# Altium project EMG_Sensor_Board.PrjPcb (part 1 of 2)
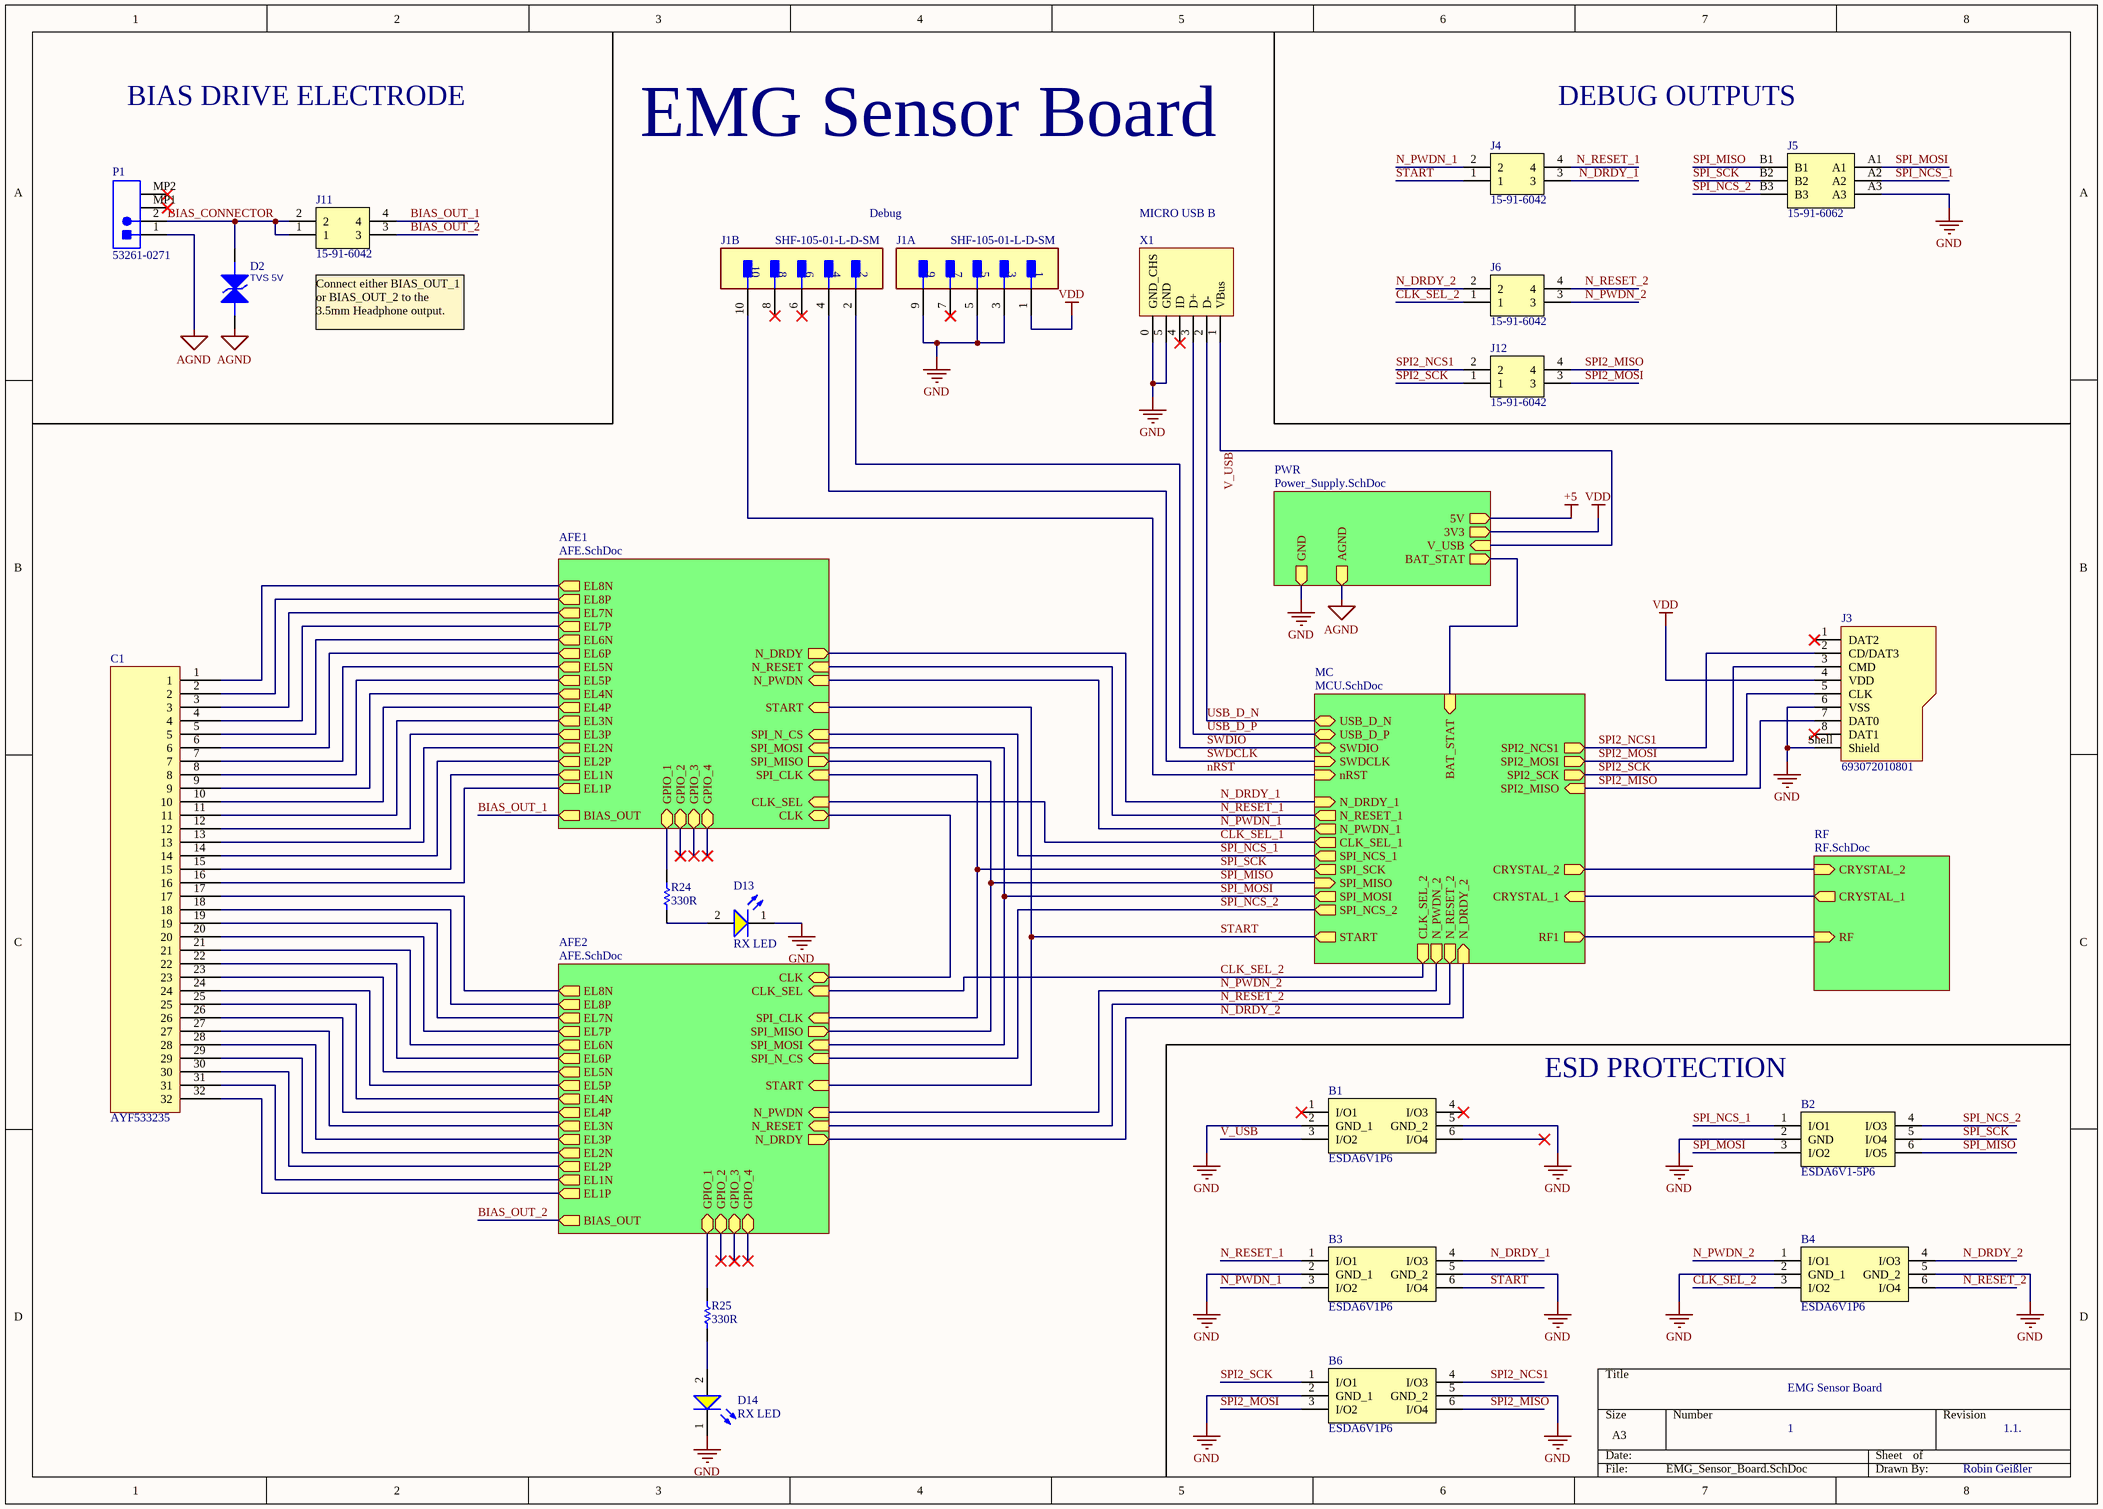
[diagram p0: EMG_Sensor_Board.SchDoc]
6 sheets, 216 parts. Net scope: hierarchical (ports join the sheet entries above them; power ports are global).
Board file: PCB1.PcbDoc
Sheets:
  EMG_Sensor_Board.SchDoc
    MC = MCU.SchDoc
    PWR = Power_Supply.SchDoc
    AFE1 = AFE.SchDoc
      FL7 = Filter.SchDoc
      FL6 = Filter.SchDoc
      FL8 = Filter.SchDoc
      FL5 = Filter.SchDoc
      FL4 = Filter.SchDoc
      FL3 = Filter.SchDoc
      FL2 = Filter.SchDoc
      FL1 = Filter.SchDoc
    RF = RF.SchDoc
    AFE2 = AFE.SchDoc
      FL7 = Filter.SchDoc
      FL6 = Filter.SchDoc
      FL8 = Filter.SchDoc
      FL5 = Filter.SchDoc
      FL4 = Filter.SchDoc
      FL3 = Filter.SchDoc
      FL2 = Filter.SchDoc
      FL1 = Filter.SchDoc

## Sheet EMG_Sensor_Board.SchDoc: EMG Sensor Board
size A3; Date: 15.05.2024; Author: Robin Geißler; CompanyName: Fraunhofer EMFT; DrawnBy: Robin Geißler; Revision: 1.1.; SheetNumber: 1; SheetTotal: 6

### Parts
B1  ESDA6V1P6  [ESDA6V1P6]
B2  ESDA6V1-5P6  [ESDA6V15P6]
B3  ESDA6V1P6  [ESDA6V1P6]
B4  ESDA6V1P6  [ESDA6V1P6]
B6  ESDA6V1P6  [ESDA6V1P6]
C1  AYF533235  [AYF533235]
D2  TVS 5V  [C-1608 [0603]-N]
D13  RX LED  [WL-SMCW_0603_150060xx75000]
D14  RX LED  [WL-SMCW_0603_150060xx75000]
J1  SHF-105-01-L-D-SM  [FP-SHF-105-01-L-D-SM-MFG]  (parts A,B of 2)
J3  693072010801  [693072010801]
J4  15-91-6042  [15916042]
J5  15-91-6062  [15916062]
J6  15-91-6042  [15916042]
J11  15-91-6042  [15916042]
J12  15-91-6042  [15916042]
P1  53261-0271  [MOLX-53261-0271_V]
R24  330R  [RESC1608X55X30LL15T15]
R25  330R  [RESC1608X55X30LL15T15]
X1  MICRO USB B  [Micro USB B]

### Sub-sheets
AFE1 = AFE.SchDoc: SPI_MISO (out), SPI_N_CS (in), SPI_CLK (in), N_DRDY (out), CLK (bidir), CLK_SEL (in), GPIO_1 (bidir), GPIO_2 (bidir), GPIO_3 (bidir), GPIO_4 (bidir), START (in), N_RESET (in), N_PWDN (in), EL1P (out), EL1N (out), EL2P (out), EL2N (out), EL3P (out), EL3N (out), EL4P (out), EL4N (out), EL5P (out), EL5N (out), EL6P (out), EL6N (out), EL7P (out), EL7N (out), EL8P (out), EL8N (out), BIAS_OUT (out), SPI_MOSI (in)
AFE2 = AFE.SchDoc: SPI_MISO (out), SPI_N_CS (in), SPI_CLK (in), N_DRDY (out), CLK (bidir), CLK_SEL (in), GPIO_1 (bidir), GPIO_2 (bidir), GPIO_3 (bidir), GPIO_4 (bidir), START (in), N_RESET (in), N_PWDN (in), EL1P (out), EL1N (out), EL2P (out), EL2N (out), EL3P (out), EL3N (out), EL4P (out), EL4N (out), EL5P (out), EL5N (out), EL6P (out), EL6N (out), EL7P (out), EL7N (out), EL8P (out), EL8N (out), BIAS_OUT (out), SPI_MOSI (in)
MC = MCU.SchDoc: SWDIO (bidir), SWDCLK (in), nRST (in), SPI_SCK (out), SPI_MISO (in), SPI_MOSI (out), SPI_NCS_1 (out), SPI_NCS_2 (out), USB_D_P (bidir), USB_D_N (bidir), RF1 (out), START (out), N_DRDY_1 (in), N_RESET_1 (out), N_PWDN_1 (out), N_DRDY_2 (in), N_RESET_2 (out), N_PWDN_2 (out), CLK_SEL_1 (out), CLK_SEL_2 (out), CRYSTAL_2 (out), CRYSTAL_1 (in), BAT_STAT (in), SPI2_MOSI (out), SPI2_MISO (in), SPI2_SCK (out), SPI2_NCS1 (out)
PWR = Power_Supply.SchDoc: V_USB (in), BAT_STAT (out), 5V (out), 3V3 (out), GND (out), AGND (out)
RF = RF.SchDoc: RF (in), CRYSTAL_1 (out), CRYSTAL_2 (in)

### Nets
AGND: D2.2(ANODE) P1.1 ; sheet PWR/AGND
GND: B1.2(GND_1) B1.5(GND_2) B2.2(GND) B3.2(GND_1) B3.5(GND_2) B4.2(GND_1) B4.5(GND_2) B6.2(GND_1) B6.5(GND_2) D13.1(K) D14.1(K) J1.3 J1.5 J1.9 J3.6(VSS) J3.Shell(Shield) J5.A3 X1.0(GND_CHS) X1.5(GND) ; sheet PWR/GND
VDD: J1.1 J3.4(VDD) ; sheet PWR/3V3  [project net 3V3]
BAT_STAT: sheet MC/BAT_STAT, sheet PWR/BAT_STAT
BIAS_CONNECTOR: D2.1(CATHODE) J11.1 J11.2 P1.2
BIAS_OUT_1: J11.4 ; sheet AFE1/BIAS_OUT
BIAS_OUT_2: J11.3 ; sheet AFE2/BIAS_OUT
CLK_SEL_1: sheet MC/CLK_SEL_1, sheet AFE1/CLK_SEL
CLK_SEL_2: B4.3(I/O2) J6.1 ; sheet MC/CLK_SEL_2, sheet AFE2/CLK_SEL
CRYSTAL_1: sheet MC/CRYSTAL_1, sheet RF/CRYSTAL_1
CRYSTAL_2: sheet MC/CRYSTAL_2, sheet RF/CRYSTAL_2
N_DRDY_1: B3.4(I/O3) J4.3 ; sheet MC/N_DRDY_1, sheet AFE1/N_DRDY
N_DRDY_2: B4.4(I/O3) J6.2 ; sheet MC/N_DRDY_2, sheet AFE2/N_DRDY
N_PWDN_1: B3.3(I/O2) J4.2 ; sheet MC/N_PWDN_1, sheet AFE1/N_PWDN
N_PWDN_2: B4.1(I/O1) J6.3 ; sheet MC/N_PWDN_2, sheet AFE2/N_PWDN
N_RESET_1: B3.1(I/O1) J4.4 ; sheet MC/N_RESET_1, sheet AFE1/N_RESET
N_RESET_2: B4.6(I/O4) J6.4 ; sheet MC/N_RESET_2, sheet AFE2/N_RESET
nRST: J1.10 ; sheet MC/nRST
RF1: sheet MC/RF1, sheet RF/RF
SPI2_MISO: B6.6(I/O4) J3.7(DAT0) J12.4 ; sheet MC/SPI2_MISO
SPI2_MOSI: B6.3(I/O2) J3.3(CMD) J12.3 ; sheet MC/SPI2_MOSI
SPI2_NCS1: B6.4(I/O3) J3.2(CD/DAT3) J12.2 ; sheet MC/SPI2_NCS1
SPI2_SCK: B6.1(I/O1) J3.5(CLK) J12.1 ; sheet MC/SPI2_SCK
SPI_MISO: B2.6(I/O5) J5.B1 ; sheet MC/SPI_MISO, sheet AFE1/SPI_MISO, sheet AFE2/SPI_MISO
SPI_MOSI: B2.3(I/O2) J5.A1 ; sheet MC/SPI_MOSI, sheet AFE1/SPI_MOSI, sheet AFE2/SPI_MOSI
SPI_NCS_1: B2.1(I/O1) J5.A2 ; sheet MC/SPI_NCS_1, sheet AFE1/SPI_N_CS
SPI_NCS_2: B2.4(I/O3) J5.B3 ; sheet MC/SPI_NCS_2, sheet AFE2/SPI_N_CS
SPI_SCK: B2.5(I/O4) J5.B2 ; sheet MC/SPI_SCK, sheet AFE1/SPI_CLK, sheet AFE2/SPI_CLK
START: B3.6(I/O4) J4.1 ; sheet MC/START, sheet AFE1/START, sheet AFE2/START
SWDCLK: J1.4 ; sheet MC/SWDCLK
SWDIO: J1.2 ; sheet MC/SWDIO
USB_D_N: X1.2(D-) ; sheet MC/USB_D_N
USB_D_P: X1.3(D+) ; sheet MC/USB_D_P
V_USB: B1.3(I/O2) X1.1(VBus) ; sheet PWR/V_USB
NetC1_1: C1.1 ; sheet AFE1/EL8N
NetC1_2: C1.2 ; sheet AFE1/EL8P
NetC1_3: C1.3 ; sheet AFE1/EL7N
NetC1_4: C1.4 ; sheet AFE1/EL7P
NetC1_5: C1.5 ; sheet AFE1/EL6N
NetC1_6: C1.6 ; sheet AFE1/EL6P
NetC1_7: C1.7 ; sheet AFE1/EL5N
NetC1_8: C1.8 ; sheet AFE1/EL5P
NetC1_9: C1.9 ; sheet AFE1/EL4N
NetC1_10: C1.10 ; sheet AFE1/EL4P
NetC1_11: C1.11 ; sheet AFE1/EL3N
NetC1_12: C1.12 ; sheet AFE1/EL3P
NetC1_13: C1.13 ; sheet AFE1/EL2N
NetC1_14: C1.14 ; sheet AFE1/EL2P
NetC1_15: C1.15 ; sheet AFE1/EL1N
NetC1_16: C1.16 ; sheet AFE1/EL1P
NetC1_17: C1.17 ; sheet AFE2/EL8N
NetC1_18: C1.18 ; sheet AFE2/EL8P
NetC1_19: C1.19 ; sheet AFE2/EL7N
NetC1_20: C1.20 ; sheet AFE2/EL7P
NetC1_21: C1.21 ; sheet AFE2/EL6N
NetC1_22: C1.22 ; sheet AFE2/EL6P
NetC1_23: C1.23 ; sheet AFE2/EL5N
NetC1_24: C1.24 ; sheet AFE2/EL5P
NetC1_25: C1.25 ; sheet AFE2/EL4N
NetC1_26: C1.26 ; sheet AFE2/EL4P
NetC1_27: C1.27 ; sheet AFE2/EL3N
NetC1_28: C1.28 ; sheet AFE2/EL3P
NetC1_29: C1.29 ; sheet AFE2/EL2N
NetC1_30: C1.30 ; sheet AFE2/EL2P
NetC1_31: C1.31 ; sheet AFE2/EL1N
NetC1_32: C1.32 ; sheet AFE2/EL1P
NetD13_2: D13.2(A) R24.1
NetD14_2: D14.2(A) R25.2
NetR24_2: R24.2 ; sheet AFE1/GPIO_1
NetR25_1: R25.1 ; sheet AFE2/GPIO_1
NetU?#1_37: sheet AFE1/CLK, sheet AFE2/CLK

Not connected (* = marked no-connect by the designer): B1 1(I/O1)* 4(I/O3)* 6(I/O4)*; J1 6* 7* 8*; J3 1(DAT2)* 8(DAT1)*; P1 MP1* MP2*; X1 4(ID)*

### Notes on the sheet
- BIAS DRIVE ELECTRODE
- DEBUG OUTPUTS
- EMG Sensor Board
- Debug
- (near J11) Connect either BIAS_OUT_1 or BIAS_OUT_2 to the 3.5mm Headphone output.
- ESD PROTECTION

### Library data of the parts
B1 B3 B4 B6 = ESDA6V1P6: 4 line ESD protection, 6.1 V VBR, in SOT666; Manufacturer_Name: STMicroelectronics; Geometry.Height: 0.62mm; Manufacturer_Part_Number: ESDA6V1P6; Mouser Part Number: 511-ESDA6V1P6; Mouser Price/Stock: https://www.mouser.co.uk/ProductDetail/STMicroelectronics/ESDA6V1P6?qs=ewe0KQ%2FSs5H0%252BSAub%2FR2ag%3D%3D; Arrow Part Number: ESDA6V1P6; Arrow Price/Stock: https://www.arrow.com/en/products/esda6v1p6/stmicroelectronics?region=nac; Datasheet Link: https://www.st.com/resource/en/datasheet/esda14v2bp6.pdf
  B1 B3: Supplier 1: Mouser; Supplier Part Number 1: 511-ESDA6V1P6
B2 = ESDA6V1-5P6: 5 line ESD protection, 6.1 V VBR, in SOT666; Manufacturer_Name: STMicroelectronics; Geometry.Height: 0.62mm; Manufacturer_Part_Number: ESDA6V1-5P6; Mouser Part Number: 511-ESDA6V1-5P6; Mouser Price/Stock: https://www.mouser.co.uk/ProductDetail/STMicroelectronics/ESDA6V1-5P6?qs=at%2FPaO0D8JbsyvB5MtIioA%3D%3D; Arrow Part Number: ESDA6V1-5P6; Arrow Price/Stock: https://www.arrow.com/en/products/esda6v1-5p6/stmicroelectronics?region=nac; Datasheet Link: https://www.st.com/resource/en/datasheet/esda14v2bp6.pdf
D2 = D_TVS_0603_CG0603MLU-05E: ESD-Entstörer/TVS-Dioden CHIP GUARD 5VOLT; Supplier 1 No: 652-CG0603MLU-05E; Supplier 1: Mouser
D13 D14 = CMP-1426-00005-2: NexarPartId: 29687085; Wavelength: 590nm; Luminous Intensity: 120mcd; Peak Wavelength: 595nm; Forward Current: 100mA; Power Dissipation: 72mW; Color: Yellow; Forward Voltage: 2V; Test Current: 20mA; Reverse Voltage: 5V; Lens Style: Clear, Rectangular; Max Junction Temperature (Tj): 95°C; Viewing Angle: 140°; Case Code (Imperial): 0603; Height: 700µm; REACH SVHC: Unknown; Dominant Wavelength: 590nm; Min Operating Temperature: -40°C; Width: 800µm; Mount: Surface Mount; Packaging: Tape and Reel; Max Operating Temperature: 85°C; RoHS: Compliant; Max Reverse Voltage (DC): 5V; Case Code (Metric): 1608; Length: 1.6mm; Case/Package: 0603
J1 = CMP-02766-000087-1: CONN HEADER SMD 10POS 1.27MM; Manufacturer: Samtec; Number Of Contacts: 10; Conn Gender: Male; Conn Orientation: Straight; Automotive: No; Lead Free: Yes; Contact Material: Gold,Nickel; Digikey Description: CONN HEADER SMD 10POS 1.27MM; Device Class L3: unset; Device Class L2: Headers and Wire Housings; RoHS: TRUE; Number Of Rows: 2; Package: SHF-105-01-L-D-SM; Pitch: 1.27mm; Octopart: https://octopart.com/shf-105-01-l-d-sm-samtec-17879411; Temperature Range Low: -55°C; Height: 5.59mm; ComponentLink2Description: Datasheet; Category: Conn; Manufacturer Part Number: SHF-105-01-L-D-SM; Device Class L1: Connectors; Mouser Description: In a Pack of 2, Samtec SHF, 1.27mm Pitch, 10 Way, 2 Row, Straight PCB Header, Surface Mount; Temperature Range High: +125°C; ComponentLink2URL: http://suddendocs.samtec.com/catalog_english/shf.pdf; Footprint Url: http://suddendocs.samtec.com/prints/shf-1xx-01-x-d-xx-xx-footprint.pdf; Temperature: -55°C to +125°C
J3 = CMP-1502-00164-2: NexarPartId: 22866686; Voltage Rating: 100V; Insulation Resistance: 1GΩ; Current Rating: 500mA; Memory Type: FLASH; Number of Positions: 8; Connector Type: Connector; Width: 13.5mm; Number of Pins: 8; REACH SVHC: Unknown; Contact Material: Copper, Gold; Contact Plating: Gold; Max Operating Temperature: 85°C; Color: Black; Operating Supply Voltage: 100V; Packaging: Tape and Reel; RoHS: Compliant; Height: 1.75mm; Number of Contacts: 8; Mount: Surface Mount; Length: 14.5mm; Min Operating Temperature: -25°C
J4 J6 J11 J12 = 15-91-6042: 2.54mm Pitch SL Wire-to-Board Header, Low Profile, Surface Mount, Single Row, Right-Angle, 3.05mm Pocket, Shrouded, with Press-fit Plastic Peg,  Circuits, Tin (Sn) Plating, Embossed Tape Packaging; Manufacturer_Name: Molex; Geometry.Height: 11.69mm; Manufacturer_Part_Number: 15-91-6042; Mouser Part Number: 538-15-91-6042; Mouser Price/Stock: https://www.mouser.co.uk/ProductDetail/Molex/15-91-6042?qs=3DzawVMofg8HeBuyct9LCA%3D%3D; Arrow Part Number: *; Arrow Price/Stock: *; Datasheet Link: https://componentsearchengine.com/Datasheets/1/15-91-6042.pdf
J5 = 15-91-6062: 2.54mm Pitch SL Wire-to-Board Header, Low Profile, Surface Mount, Single Row, Right-Angle, 3.05mm Pocket, Shrouded, with Press-fit Plastic Peg,  Circuits, Tin (Sn) Plating, Embossed Tape Packaging; Manufacturer_Name: Molex; Geometry.Height: 9.91mm; Manufacturer_Part_Number: 15-91-6062; Mouser Part Number: 538-15-91-6062; Mouser Price/Stock: https://www.mouser.co.uk/ProductDetail/Molex/15-91-6062?qs=Wx%252BBqzKDvcssfuSpK%2FN0NQ%3D%3D; Arrow Part Number: *; Arrow Price/Stock: *; Datasheet Link: https://www.molex.com/content/dam/molex/molex-dot-com/products/automated/en-us/salesdrawingpdf/713/71308/015916062_sd.pdf
P1 = CMP-2000-05633-1: PicoBlade(TM) Header, Right Angle, -40 to 85 degC, 2-Pin SMD, RoHS, Tape and Reel; Current - Max: 1A; Brand: Molex; Voltage Rating: 125V; Number of Positions: 2; Pitch: 1.25mm; Package Version: Rev. H, 11/2014; Factory Pack Quantity: 1000; Datasheet URL: http://www.molex.com/webdocs/datasheets/pdf/en-us/0532610271_PCB_HEADERS.pdf; Datasheet Version: 03/2016; Housing Material: Thermoplastic; RoHS: Details; Product Type: Headers; Number of Rows: 1; Termination Style: SMD; Mounting Technology: SurfaceMount; Number of Positions / Contacts: 2; Package URL: http://www.molex.com/pdm_docs/sd/532610271_sd.pdf; Mounting Angle: Right; Mounting Style: SMD/SMT; Manufacturer: Molex; Product Category: 1.25mmConnectors; Tradename: PicoBlade; Voltage - Max: 125V; Manufacturer URL: http://www.molex.com/; Series: 53261; Package Description: 2-Leads Header, Pitch 1.25 mm, Mated Height 3.4 mm; Package Reference: 53261-0271; Current Rating: 1A; Contact Plating: Tin; Contact Material: PhosphorBronze; Type: Shrouded; Packaging: Reel
R24 R25 = CMP-2000-00435-2: Chip Resistor, 330 Ohm, +/- 1%, 0.1 W, -55 to 155 degC, 0603 (1608 Metric), RoHS, Tape and Reel; Gender: Male; Mating Cycles: 10000; Current Rating: 500 mA; Voltage Rating: 10 V; REACH SVHC: No SVHC; PackageDescription: 2-Pin Surface Mount Device, Body 1.6 x 0.85 mm; Contact Finish: Gold; Pins: 8; ComponentLink1Description: Manufacturer URL; Packaging: Tape and Reel; Max Operating Temperature: 85 degC; Contact Material: Copper; Height: 1.45 mm; Width: 1.45 mm; DatasheetVersion: Apr-15; Package Quantity: 1500; Contact Plating: Gold; PackageReference: 0603; Mount: Surface Mount; Lead Pitch: 1.1 mm; Min Operating Temperature: -25 degC; ComponentLink1URL: http://www.panasonic.com/; ComponentLink2URL: http://industrial.panasonic.com/cdbs/www-data/pdf/RDA0000/AOA0000C86.pdf; Length: 13.7 mm; ComponentLink2Description: Datasheet; RoHSCompliant: true
X1 = MICRO USB B: MICRO USB B Molex; Supplier 1: Mouser; Supplier Part Number 1: 538-47346-0001

## Sheet MCU.SchDoc: Main Control Unit
size A4; DrawnBy: Robin Geißler; Revision: 1.0.; SheetNumber: 3; SheetTotal: 6
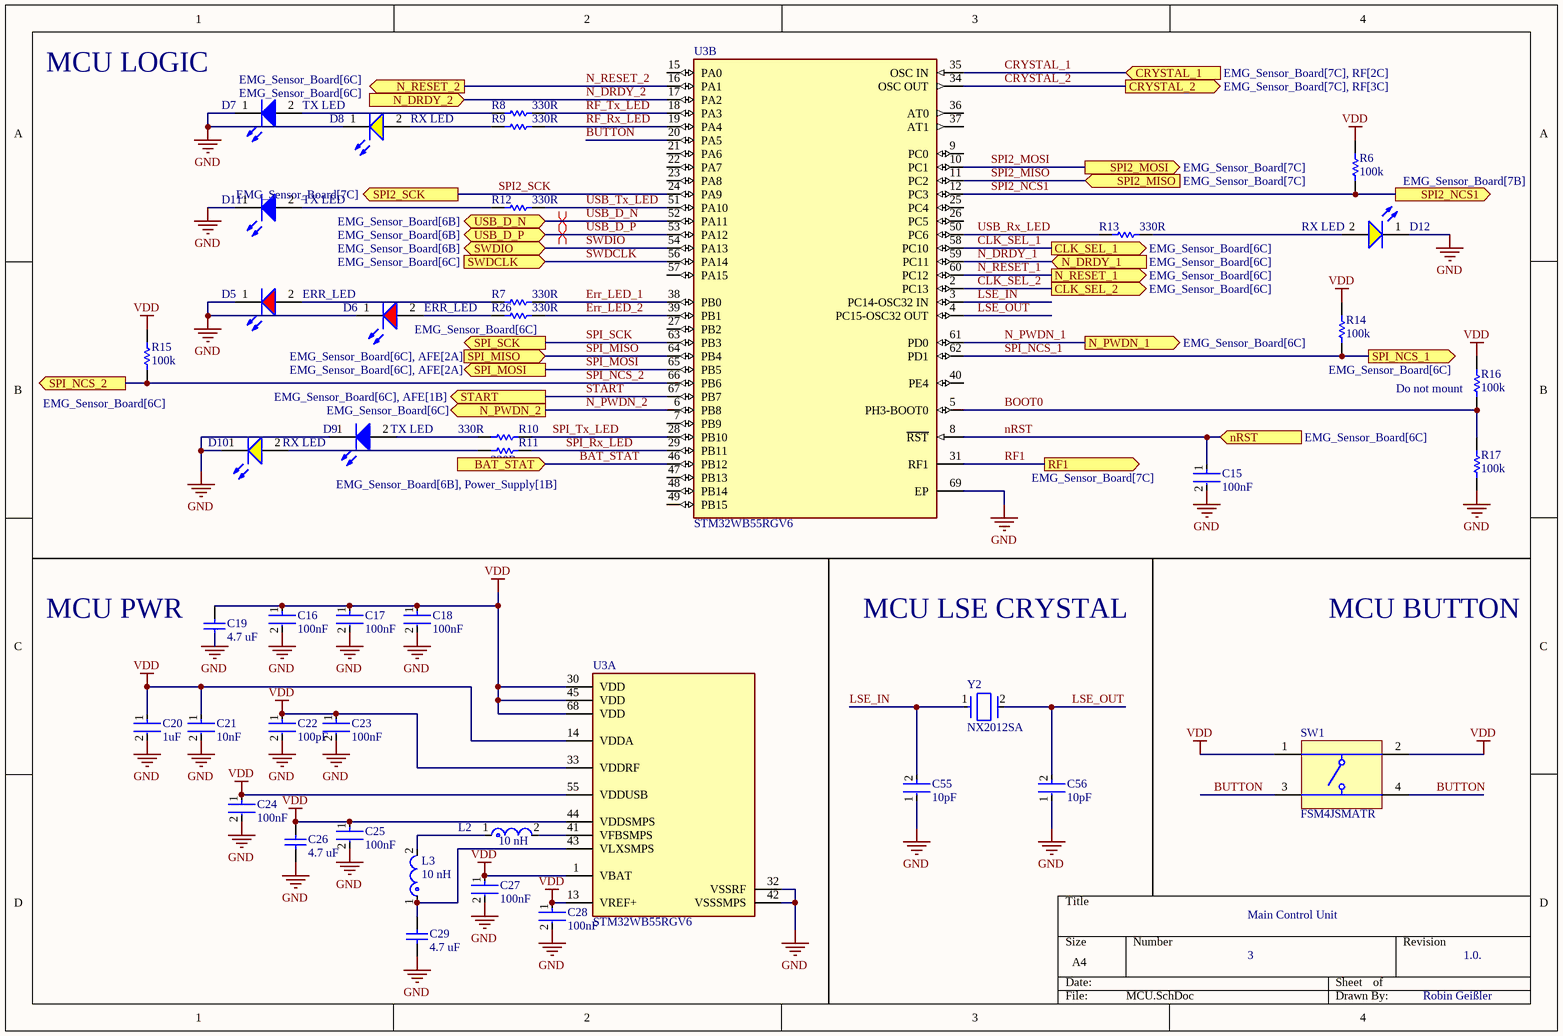
[diagram p1: MCU.SchDoc]

### Parts
C15  100nF  [FP-CGA3E-0_3-0_1-IPC_A]
C16  100nF  [FP-CGA3E-0_3-0_1-IPC_A]
C17  100nF  [FP-CGA3E-0_3-0_1-IPC_A]
C18  100nF  [FP-CGA3E-0_3-0_1-IPC_A]
C19  4.7 uF  [C-1608 [0603]-N]
C20  1uF  [FP-CGA3E-0_3-0_1-IPC_B]
C21  10nF  [FP-CC0603-DA-MFG]
C22  100pF  [FP-C0603C-CF-MFG]
C23  100nF  [FP-CGA3E-0_3-0_1-IPC_A]
C24  100nF  [FP-CGA3E-0_3-0_1-IPC_A]
C25  100nF  [FP-CGA3E-0_3-0_1-IPC_A]
C26  4.7 uF  [C-1608 [0603]-N]
C27  100nF  [FP-CGA3E-0_3-0_1-IPC_A]
C28  100nF  [FP-CGA3E-0_3-0_1-IPC_A]
C29  4.7 uF  [C-1608 [0603]-N]
C55  10pF  [FP-C1608-080-0_1-IPC_C]
C56  10pF  [FP-C1608-080-0_1-IPC_C]
D5  ERR_LED  [WL-SMCW_0603_150060xx75000]
D6  ERR_LED  [WL-SMCW_0603_150060xx75000]
D7  TX LED  [WL-SMCW_0603_150060xx75000]
D8  RX LED  [WL-SMCW_0603_150060xx75000]
D9  TX LED  [WL-SMCW_0603_150060xx75000]
D10  RX LED  [WL-SMCW_0603_150060xx75000]
D11  TX LED  [WL-SMCW_0603_150060xx75000]
D12  RX LED  [WL-SMCW_0603_150060xx75000]
L2  10 nH  [FP-LQG18HH_00-MFG]
L3  10 nH  [FP-LQG18HH_00-MFG]
R6  100k  [RESC1609X55X30ML10T20]
R7  330R  [RESC1608X55X30LL15T15]
R8  330R  [RESC1608X55X30LL15T15]
R9  330R  [RESC1608X55X30LL15T15]
R10  330R  [RESC1608X55X30LL15T15]
R11  330R  [RESC1608X55X30LL15T15]
R12  330R  [RESC1608X55X30LL15T15]
R13  330R  [RESC1608X55X30LL15T15]
R14  100k  [RESC1609X55X30ML10T20]
R15  100k  [RESC1609X55X30ML10T20]
R16  100k  [RESC1609X55X30ML10T20]
R17  100k  [RESC1609X55X30ML10T20]
R26  330R  [RESC1608X55X30LL15T15]
SW1  FSM4JSMATR  [TECO-FSM4JSMATR_V]
U3  STM32WB55RGV6  [FP-VFQFPN-68-B029-MFG]  (parts A,B of 2)
Y2  NX2012SA  [FP-NX2012SA-MFG]

### Ports
BAT_STAT (in, see EMG_Sensor_Board[6B], Power_Supply[1B]), CLK_SEL_1 (out, see EMG_Sensor_Board[6C]), CLK_SEL_2 (out, see EMG_Sensor_Board[6C]), CRYSTAL_1 (in, see EMG_Sensor_Board[7C], RF[2C]), CRYSTAL_2 (out, see EMG_Sensor_Board[7C], RF[3C]), N_DRDY_1 (in, see EMG_Sensor_Board[6C]), N_DRDY_2 (in, see EMG_Sensor_Board[6C]), N_PWDN_1 (out, see EMG_Sensor_Board[6C]), N_PWDN_2 (out, see EMG_Sensor_Board[6C]), N_RESET_1 (out, see EMG_Sensor_Board[6C]), N_RESET_2 (out, see EMG_Sensor_Board[6C]), nRST (in, see EMG_Sensor_Board[6C]), RF1 (out, see EMG_Sensor_Board[7C]), SPI2_MISO (in, see EMG_Sensor_Board[7C]), SPI2_MOSI (out, see EMG_Sensor_Board[7C]), SPI2_NCS1 (out, see EMG_Sensor_Board[7B]), SPI2_SCK (out, see EMG_Sensor_Board[7C]), SPI_MISO (in, see EMG_Sensor_Board[6C], AFE[2A]), SPI_MOSI (out, see EMG_Sensor_Board[6C], AFE[2A]), SPI_NCS_1 (out, see EMG_Sensor_Board[6C]), SPI_NCS_2 (out, see EMG_Sensor_Board[6C]), SPI_SCK (out, see EMG_Sensor_Board[6C]), START (out, see EMG_Sensor_Board[6C], AFE[1B]), SWDCLK (in, see EMG_Sensor_Board[6C]), SWDIO (bidir, see EMG_Sensor_Board[6B]), USB_D_N (bidir, see EMG_Sensor_Board[6B]), USB_D_P (bidir, see EMG_Sensor_Board[6B])

### Nets
GND: C15.2 C16.2 C17.2 C18.2 C19.1 C20.2 C21.2 C22.2 C23.2 C24.2 C25.2 C26.1 C27.2 C28.2 C29.1 C55.1 C56.1 D5.1(K) D6.1(K) D7.1(K) D8.1(K) D9.1(K) D10.1(K) D11.1(K) D12.1(K) R17.1 U3.32(VSSRF) U3.42(VSSSMPS) U3.69(EP)
VDD: C16.1 C17.1 C18.1 C19.2 C20.1 C21.1 C22.1 C23.1 C24.1 C25.1 C26.2 C27.1 C28.1 R6.2 R14.2 R15.2 R16.2 SW1.1 SW1.2 U3.1(VBAT) U3.13(VREF+) U3.14(VDDA) U3.30(VDD) U3.33(VDDRF) U3.44(VDDSMPS) U3.45(VDD) U3.55(VDDUSB) U3.68(VDD)  [project net 3V3]
BAT_STAT: U3.46(PB12) ; port BAT_STAT
BOOT0: R16.1 R17.2 U3.5(PH3-BOOT0)
BUTTON: SW1.3 SW1.4 U3.20(PA5)
CLK_SEL_1: U3.58(PC10) ; port CLK_SEL_1
CLK_SEL_2: U3.2(PC13) ; port CLK_SEL_2
CRYSTAL_1: U3.35(OSC_IN) ; port CRYSTAL_1
CRYSTAL_2: U3.34(OSC_OUT) ; port CRYSTAL_2
Err_LED_1: R7.2 U3.38(PB0)
Err_LED_2: R26.2 U3.39(PB1)
LSE_IN: C55.2 U3.3(PC14-OSC32_IN) Y2.1
LSE_OUT: C56.2 U3.4(PC15-OSC32_OUT) Y2.2
N_DRDY_1: U3.59(PC11) ; port N_DRDY_1
N_DRDY_2: U3.17(PA2) ; port N_DRDY_2
N_PWDN_1: U3.61(PD0) ; port N_PWDN_1
N_PWDN_2: U3.6(PB8) ; port N_PWDN_2
N_RESET_1: U3.60(PC12) ; port N_RESET_1
N_RESET_2: U3.16(PA1) ; port N_RESET_2
nRST: C15.1 U3.8(~{RST}) ; port nRST
RF1: U3.31(RF1) ; port RF1
RF_Rx_LED: R9.2 U3.19(PA4)
RF_Tx_LED: R8.2 U3.18(PA3)
SPI2_MISO: U3.11(PC2) ; port SPI2_MISO
SPI2_MOSI: U3.10(PC1) ; port SPI2_MOSI
SPI2_NCS1: R6.1 U3.12(PC3) ; port SPI2_NCS1
SPI2_SCK: U3.24(PA9) ; port SPI2_SCK
SPI_MISO: U3.64(PB4) ; port SPI_MISO
SPI_MOSI: U3.65(PB5) ; port SPI_MOSI
SPI_NCS_1: R14.1 U3.62(PD1) ; port SPI_NCS_1
SPI_NCS_2: R15.1 U3.66(PB6) ; port SPI_NCS_2
SPI_Rx_LED: R11.1 U3.29(PB11)
SPI_SCK: U3.63(PB3) ; port SPI_SCK
SPI_Tx_LED: R10.1 U3.28(PB10)
START: U3.67(PB7) ; port START
SWDCLK: U3.56(PA14) ; port SWDCLK
SWDIO: U3.54(PA13) ; port SWDIO
USB_D_N: U3.52(PA11) ; port USB_D_N
USB_D_P: U3.53(PA12) ; port USB_D_P
USB_Rx_LED: R13.1 U3.50(PC6)
USB_Tx_LED: R12.2 U3.51(PA10)
NetC29_2: C29.2 L3.1 U3.43(VLXSMPS)
NetD5_2: D5.2(A) R7.1
NetD6_2: D6.2(A) R26.1
NetD7_2: D7.2(A) R8.1
NetD8_2: D8.2(A) R9.1
NetD9_2: D9.2(A) R10.2
NetD10_2: D10.2(A) R11.2
NetD11_2: D11.2(A) R12.1
NetD12_2: D12.2(A) R13.2
NetL2_1: L2.1 L3.2
NetL2_2: L2.2 U3.41(VFBSMPS)

Not connected (* = marked no-connect by the designer): U3 7(PB9) 9(PC0) 15(PA0) 21(PA6) 22(PA7) 23(PA8) 25(PC4) 26(PC5) 27(PB2) 36(AT0) 37(AT1) 40(PE4) 47(PB13) 48(PB14) 49(PB15) 57(PA15)

### Layout directives
differential pair: USB_D_N, USB_D_P

### Notes on the sheet
- MCU LOGIC
- (near R16) Do not mount
- MCU PWR
- MCU LSE CRYSTAL
- MCU BUTTON

### Library data of the parts
C15-C18 C23-C25 C27 C28 = CMP-2000-07546-2: Cap Ceramic 100nF 50V X7R 10% Pad SMD 0603 +125°C Automotive T/R; Weight: 7.1E-05oz; Composition: Ceramic; Max Operating Temperature: 125°C; Termination: SMD/SMT; Dielectric: X7R; Length: 1.6mm; Package Quantity: 1; REACH SVHC: No SVHC; Lead Free: Lead Free; Case Code (Metric): 1608; Min Operating Temperature: -55°C; Packaging: Tape and Reel; Tolerance: 10%; Voltage Rating: 50V; Case Code (Imperial): 0603; Capacitance: 100nF; Case/Package: 0603; Voltage Rating (DC): 50V; Depth: 0.8mm; Radiation Hardening: No; Ratings: AEC-Q200; Mount: Surface Mount; Voltage: 50V; Thickness: 0.035inch; Width: 0.8mm; Height: 0.8mm
C19 C26 C29 = C4u7_0603_C1608X5R1C475K080AE: CAP CER 0603 16V 4.70uF X5R 10%; Supplier 1: Mouser; Supplier Part Number 1: 810-C1608X5R1C475KE
C20 = CMP-08246-002551-1: Cap Ceramic 1uF 35V X7R 10% Pad SMD 0603 +125°C Automotive T/R; Termination: SMD/SMT; Packaging: Tape and Reel; Capacitance: 1uF; Tolerance: 10%; Mount: Surface Mount; Thickness: 0.035inch; Case Code (Imperial): 0603; Voltage Rating: 35V; Case/Package: 0603; Case Code (Metric): 1608; Dielectric: X7R; Width: 0.031inch; Length: 0.063inch; Min Operating Temperature: -55°C; Weight: 7.1E-05oz; Max Operating Temperature: 125°C; Voltage Rating (DC): 35V; Height: 0.8mm; Ratings: AEC-Q200; Package Quantity: 4000
C21 = CMP-2100-03600-2: CAP CER 10000PF 50V X7R 0603; Manufacturer Part Number: CC0603KRX7R9BB103; Manufacturer: YAGEO; Tolerance: 0.1; Material: Ceramic; Temperature Coefficient: 15%; Mouser Description: Multilayer Ceramic Capacitor, CC Series, 0.01 - F, - 10%, X7R, 50 V, 0603 [1608 Metric]; Digikey Description: CAP CER 10000PF 50V X7R 0603; Height: 0.9mm; Category: Cap; Temperature Characteristic: X7R; Footprint Url: http://www.yageo.com/exep/pages/download/literatures/UPY-C_GEN_24.pdf; Lead Free: Yes; Voltage Rating: 50 V; Temperature: -55°C to +125°C; Device Class L3: Ceramic Capacitors; ComponentLink2Description: Datasheet; Voltage: 50 V; Package: CC0603-DA; Octopart: https://octopart.com/cc0603krx7r9bb103-yageo-192938; Automotive: No; Temperature Range High: +125°C; Temperature Range Low: -55°C; Value: 10 nF; RoHS: TRUE; Device Class L1: Passive Components; ComponentLink2URL: http://www.yageo.com/documents/recent/UPY-GPHC_X7R_6.3V-to-50V_18.pdf; Device Class L2: Capacitors; Capacitance: 10 nF
C22 = CMP-2006-03408-2: CAP CER 100PF 50V C0G/NP0 0603; Manufacturer Part Number: C0603C101J5GACTU; Manufacturer: KEMET; Material: Ceramic; Tolerance: 0.05; Automotive Grade: Grade 1; Temperature Coefficient: 30ppm/°C; Temperature Characteristic: C0G; RoHS: TRUE; Temperature Range Low: -55°C; Automotive: Yes; Digikey Description: CAP CER 100PF 50V C0G/NP0 0603; Voltage Rating: 50 V; Lead Free: Yes; Category: Cap; Device Class L3: Ceramic Capacitors; Mouser Description: Multilayer Ceramic Capacitor, C Series, 100 Pf, - 5%, C0g / Np0, 50 V, 0603 [1608 Metric] Rohs Compliant: Yes; Value: 100 pF; Device Class L1: Passive Components; Temperature: -55°C to +125°C; ComponentLink2URL: https://api.kemet.com/component-edge/download/datasheet/C0603C100J5GACAUTO.pdf; Temperature Range High: +125°C; ComponentLink2Description: Datasheet; Octopart: https://octopart.com/c0603c101j5gactu-kemet-100052; Device Class L2: Capacitors; Height: 0.87mm; Capacitance: 100 pF; Package: C0603C-CF
C55 C56 = CMP-08246-005843-1: Multilayer Ceramic Capacitors 10pF ±0.5pF 50V C0G SMD 0603; Temperature Coefficient: 30ppm/°C; Tolerance: 5%; Termination: SMD/SMT; REACH SVHC: No SVHC; Package Quantity: 1; Case Code (Imperial): 0603; Number of Pins: 2; Capacitance: 10pF; Length: 1.6mm; Thickness: 0.037inch; Weight: 7.1E-05oz; Voltage Rating (DC): 50V; RoHS Compliant: Yes; Width: 0.031inch; Depth: 0.8mm; Case/Package: 0603; Dielectric Material: Ceramic; Voltage: 50V; Min Operating Temperature: -55°C; Case Code (Metric): 1608; Mount: Surface Mount; Height: 0.8mm; Construction: Flat; Series: C; Packaging: Tape and Reel; Radiation Hardening: No; Max Operating Temperature: 125°C; Lead Free: Lead Free; Voltage Rating: 50V; Dielectric: C0G
D5 D6 = CMP-1426-00001-3: NexarPartId: 29717776; Color: Red; Power Dissipation: 72mW; Max Reverse Voltage (DC): 5V; Peak Wavelength: 630nm; Viewing Angle: 140°; Forward Voltage: 2V; Luminous Intensity: 250mcd; Forward Current: 100mA; Dominant Wavelength: 625nm; Lens Style: Clear, Rectangular; Max Junction Temperature (Tj): 95°C; Test Current: 20mA; Mount: Surface Mount; Packaging: Tape and Reel; Case Code (Metric): 1608; Max Operating Temperature: 85°C; Case Code (Imperial): 0603; REACH SVHC: Unknown; Width: 800µm; Length: 1.6mm; Reverse Voltage: 5V; Height: 700µm; Case/Package: 0603; RoHS: Compliant; Wavelength: 625nm; Min Operating Temperature: -40°C
D7 D9 D11 = CMP-1426-00003-3: NexarPartId: 29717775; Luminous Intensity: 145mcd; Test Current: 20mA; Max Junction Temperature (Tj): 95°C; Max Reverse Voltage (DC): 5V; Dominant Wavelength: 470nm; Power Dissipation: 105mW; Peak Wavelength: 465nm; Forward Voltage: 3.2V; Viewing Angle: 140°; Color: Blue; Forward Current: 100mA; Lens Style: Clear, Rectangular; Mount: Surface Mount; Packaging: Tape and Reel; Min Operating Temperature: -40°C; Length: 1.6mm; Max Operating Temperature: 85°C; Width: 800µm; REACH SVHC: Unknown; Height: 700µm; Case Code (Imperial): 0603; RoHS: Compliant; Case/Package: 0603; Case Code (Metric): 1608; Wavelength: 470nm; Reverse Voltage: 5V
D8 D10 D12 = CMP-1426-00005-2: as D13 on sheet EMG_Sensor_Board; Case Code (Imperial): 0603; Height: 700µm; REACH SVHC: Unknown; Dominant Wavelength: 590nm; Min Operating Temperature: -40°C; Width: 800µm; Mount: Surface Mount; Packaging: Tape and Reel; Max Operating Temperature: 85°C; RoHS: Compliant; Max Reverse Voltage (DC): 5V; Case Code (Metric): 1608; Length: 1.6mm; Case/Package: 0603
L2 L3 = CMP-06042-004616-1: Multilayer type RF Inductor 10nH ±5% 0.3Ω 650mA 0603; Test Frequency: 100MHz; Current: 35mA; DC Resistance (DCR): 300mR; Q Factor: 12; DC Current: 400mA; Self Resonant Frequency: 3.5GHz; Core Material: Air; Shielding: Unshielded; Radiation Hardening: No; Case Code (Metric): 1608; Min Operating Temperature: -40°C; Inductance: 10nH; Inductance Tolerance: 5%; Case Code (Imperial): 0603; Termination: SMD/SMT; Height: 0.8mm; Packaging: Tape and Reel; Width: 0.031inch; Military Standard: Not; Max DC Current: 400mA; Max Operating Temperature: 85°C; Package Quantity: 4000; Depth: 0.95mm; Lead Free: Lead Free; Current Rating: 400mA; Mount: Surface Mount; Tolerance: 5%; Case/Package: 0603; REACH SVHC: No SVHC; Length: 1.6mm
R6 R14-R17 = CMP-2000-03685-1: TNPW0603100KBEEA; Manufacturer: Vishay Dale; Part Number: TNPW0603100KBEEA
R7-R13 R26 = CMP-2000-00435-2: as R24 on sheet EMG_Sensor_Board; REACH SVHC: No SVHC; PackageDescription: 2-Pin Surface Mount Device, Body 1.6 x 0.85 mm; Contact Finish: Gold; Pins: 8; ComponentLink1Description: Manufacturer URL; Packaging: Tape and Reel; Max Operating Temperature: 85 degC; Contact Material: Copper; Height: 1.45 mm; Width: 1.45 mm; DatasheetVersion: Apr-15; Package Quantity: 1500; Contact Plating: Gold; PackageReference: 0603; Mount: Surface Mount; Lead Pitch: 1.1 mm; Min Operating Temperature: -25 degC; ComponentLink1URL: http://www.panasonic.com/; ComponentLink2URL: http://industrial.panasonic.com/cdbs/www-data/pdf/RDA0000/AOA0000C86.pdf; Length: 13.7 mm; ComponentLink2Description: Datasheet; RoHSCompliant: true
SW1 = CMP-2000-07486-1: Micro Miniature Push Button Switch FSM JSM, 50 mA, -35 to 85 degC, 4-Pin SMD, RoHS, Tape and Reel; Manufacturer: TE Connectivity; Mechanical Life: 100000Cycles; Current Rating: 50mA; Actuator Material: Polyamide; Max Voltage Rating (DC): 12V; Capacitance: 0f; Illumination Type: Illuminated; Voltage Rating (DC): 24V; Case\/Package: SMD/SMT; Operating Force: 160gf; Contact Resistance: 100mOhm; Actuator Length: 0.055inch; Switch Travel: 0.25mm; Throw Configuration: SPST; Termination: GullWing; Contact Plating: Silver; Orientation: Straight; Mounting Technology: SurfaceMount; REACH SVHC: Unknown; Electrical Life: 100000Cycles; Package Reference: FSM4JSMATR; Max Operating Temperature: 85degC; Manufacturer URL: http://www.te.com/; Package Description: 4-Pin Surface Mount Device, Body 6 x 6 mm, Pitch 4.5 mm; Datasheet Version: Rev. V, 02/2015; Packaging: TapeandReel; Min Operating Temperature: -35degC; Mount: SurfaceMount; Contact Current Rating: 50mA; Contact Material: CopperAlloy; Package Quantity: 1200; Datasheet URL: http://www.te.com/commerce/DocumentDelivery/DDEController?Action=showdoc&DocId=Customer+Drawing%7F2-1437565-7%7FV%7Fpdf%7FEnglish%7FENG_CD_2-1437565-7_V.pdf%7F4-1437565-2; RoHSCompliant: true
U3 = CMP-12160-000001-1: ULTRA-LOW-POWER DUAL CORE ARM CO; Manufacturer: STMicroelectronics; Max Junction Temp: +125°C; Bandwidth: 75MHz; Max Frequency: 2480MHz; Sensitivity: -96dBm; Number Of Adc Channels: 19; Receiving Current: 4.5-7.9mA; Interface: I2C,SPI,UART,USART,USB; Data Rate: 2Mbits/s; Number Of Gpio: 49; Min Supply Voltage: 1.71V; Max Power Dissipation: 425mW; Max Supply Voltage: 3.6V; Standoff Height: 0mm; Octopart: https://octopart.com/stm32wb55rgv6-stmicroelectronics-98750848; Category: IC; Digikey Description: ULTRA-LOW-POWER DUAL CORE ARM CO; Height: 1mm; Device Class L2: RF Semiconductors and Devices; Automotive: No; Ambient Temperature Range High: +105°C; ComponentLink2Description: Datasheet; Ambient Temperature Range Low: -40°C; Lead Free: Yes; Temperature Range Low: -40°C; Ipc Land Pattern Name: QFN40P800X800X90-68; Device Class L1: Integrated Circuits (ICs); Manufacturer Part Number: STM32WB55RGV6; Package: VFQFPN-68-B029; RoHS: TRUE; Temperature Range High: +125°C; ComponentLink2URL: https://www.st.com/resource/en/datasheet/stm32wb55rg.pdf; Temperature: -40°C to +125°C; Device Class L3: Transceivers; Mouser Description: MCU 32-Bit STM32WB55 ARM Cortex M4 RISC 1MB Flash 1.7V to 3.6V 68-Pin VFQFPN Tray
Y2 = CMP-200220-000019-1: CRYSTAL 32.7680KHZ 12.5PF SMD; Frequency Tolerance: 20ppm; ESR (Equivalent Series Resistance): 80kR; Frequency: 32.768kHz; Mount: Surface Mount; Packaging: Cut Tape; Min Operating Temperature: -40°C; Max Operating Temperature: 85°C; Case/Package: SMD/SMT; RoHS Compliant: Yes; Length: 0.081inch; Series: NX2012SA; Height: 0.024inch; Width: 0.047inch; Load Capacitance: 12.5pF

## Sheet Power_Supply.SchDoc: Power Supply
size A4; Author: Robin Geißler; CompanyName: Fraunhofer EMFT; DrawnBy: Robin Geißler; Revision: 1.0.; SheetNumber: 2; SheetTotal: 6
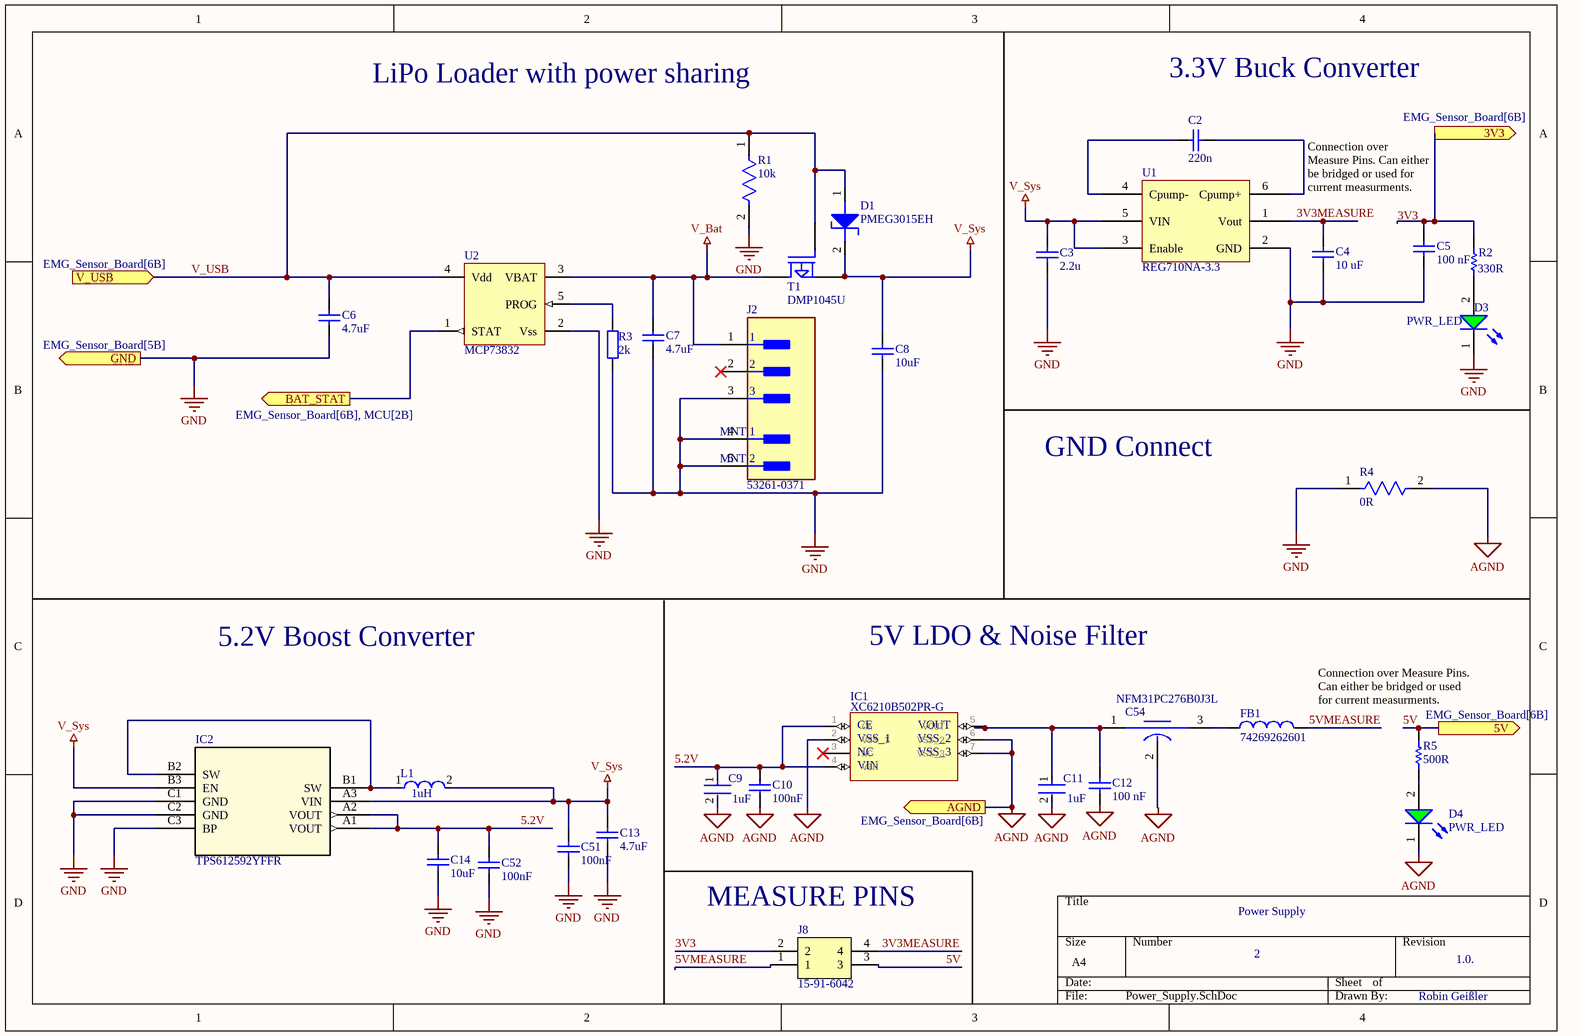
[diagram p2: Power_Supply.SchDoc]

### Parts
C2  220n  [C-1608 [0603]-N]
C3  2.2u  [C-1608 [0603]-N]
C4  10 uF  [C-1608 [0603]-N]
C5  100 nF  [C-1608 [0603]-N]
C6  4.7uF  [C-1608 [0603]-N]
C7  4.7uF  [C-1608 [0603]-N]
C8  10uF  [C-1608 [0603]-N]
C9  1uF  [FP-CGA3E-0_3-0_1-IPC_B]
C10  100nF  [C-1608 [0603]-N]
C11  1uF  [FP-CGA3E-0_3-0_1-MFG]
C12  100 nF  [C-1608 [0603]-N]
C13  4.7uF  [C-1608 [0603]-N]
C14  10uF  [C-1608 [0603]-N]
C51  100nF  [C-1608 [0603]-N]
C52  100nF  [C-1608 [0603]-N]
C54  NFM31PC276B0J3L  [FP-NFM31-0_2-MFG]
D1  PMEG3015EH  [SOD-123-D]
D3  PWR_LED  [WL-SMCW_0603_150060xx75000]
D4  PWR_LED  [WL-SMCW_0603_150060xx75000]
FB1  74269262601  [WE-TMSB_0603_HC]
IC1  XC6210B502PR-G  [XC6210B502PRG]
IC2  TPS612592YFFR  [DSBGA09_1P206X1P306_TEX]
J2  53261-0371  [FP-53261-0371-MFG]
J8  15-91-6042  [15916042]
L1  1uH  [FP-IHLP-1616BZ-FP_1_8545x-MFG]
R1  10k  [FP-RC0603-0_55-IPC_C]
R2  330R  [RESC1608X55X30LL15T15]
R3  2k  [C-1608 [0603]-N]
R4  0R  [FP-CRCW0603-e3-IPC_B]
R5  500R  [RESC1608X55X30NL15T15]
T1  DMP1045U  [SOT-23-3-PMOS]
U1  REG710NA-3.3  [SOT-23/6]
U2  MCP73832  [SOT95P280X145-5N]

### Ports
3V3 (out, see EMG_Sensor_Board[6B]), 5V (out, see EMG_Sensor_Board[6B]), AGND (out, see EMG_Sensor_Board[6B]), BAT_STAT (out, see EMG_Sensor_Board[6B], MCU[2B]), GND (out, see EMG_Sensor_Board[5B]), V_USB (in, see EMG_Sensor_Board[6B])

### Nets
3V3: C5.1 J8.2 R2.2 ; port 3V3
5V: J8.3 R5.2 ; port 5V
AGND: C9.2 C10.2 C11.2 C12.2 C54.2(GND) D4.1(K) IC1.2(VSS_1) IC1.6(VSS_2) IC1.7(VSS_3) R4.2 ; port AGND
GND: C3.1 C4.1 C5.2 C6.1 C7.1 C8.1 C13.1 C14.1 C51.2 C52.2 D3.1(K) IC2.C1(GND) IC2.C2(GND) IC2.C3(BP) J2.3 J2.4(MNT_1) J2.5(MNT_2) R1.2 R3.1 R4.1 U1.2(GND) U2.2(Vss) ; port GND
V_Bat: C7.2 J2.1 T1.2(D) U2.3(VBAT)
V_Sys: C3.2 C8.2 C13.2 C51.1 D1.2 IC2.A3(VIN) IC2.B3(EN) L1.2 T1.3(S) U1.3(Enable) U1.5(VIN)
3V3MEASURE: C4.2 J8.4 U1.1(Vout)
5.2V: C9.1 C10.1 C14.2 C52.1 IC1.1(CE) IC1.4(VIN) IC2.A1(VOUT) IC2.A2(VOUT)
5VMEASURE: FB1.2 J8.1
BAT_STAT: U2.1(STAT) ; port BAT_STAT
V_USB: C6.2 D1.1 R1.1 T1.1(G) U2.4(Vdd) ; port V_USB
NetC2_1: C2.1 U1.4(Cpump-)
NetC2_2: C2.2 U1.6(Cpump+)
NetC11_1: C11.1 C12.1 C54.1(Input) IC1.5(VOUT)
NetC54_3: C54.3(Output) FB1.1
NetD3_2: D3.2(A) R2.1
NetD4_2: D4.2(A) R5.1
NetIC2_B1: IC2.B1(SW) IC2.B2(SW) L1.1
NetR3_2: R3.2 U2.5(PROG)

Not connected (* = marked no-connect by the designer): IC1 3(NC)*; J2 2*

### Notes on the sheet
- LiPo Loader with power sharing
- 3.3V Buck Converter
- Connection over Measure Pins. Can either be bridged or used for current measurments.
- GND Connect
- 5.2V Boost Converter
- 5V LDO & Noise Filter
- (near J8) MEASURE PINS

### Library data of the parts
C2 = C220n_0603_CGA3E3X7R1H224K080AB: CAP 0603 50V 0.22uF X7R 10% AEC-Q200; Supplier 1: Mouser; Supplier Part Number 1: 810-CGA3E3X7R1H224K
C3 = C2u2_0603_GRM188R61E225KA12D: CAP 0603 2.2uF 25volts X5R 10%; Supplier 1: Mouser; Supplier Part Number 1: 81-GRM188R61E225KA2D
C4 C8 C14 = C10u_0603_GRM188R61E106KA73J: CAP CER 10UF 25V X5R 0603 10%; Supplier 1: Mouser; Supplier Part Number 1: 81-GRM188R61E106KA3J
C5 C12 = C100n_0603_C0603C104J4RAC: Multilayer Ceramic Capacitors MLCC - SMD/SMT 16volts 0.1uF 5% X7R; Manufacturer: KEMET; Capacitance: 100nF; Voltage Rating: 16V; Dissipation Factor: 3.5%; Supplier 1: Mouser; Supplier Part Number 1: 80-C0603C104J4RAC; Manufacturer Part Number: C0603C104J4RAC; Description 1: Multilayer Ceramic Capacitors MLCC - SMD/SMT 16volts 0.1uF 5% X7R; Stock 1: 0; Pricing 1: 1=0.14, 10=0.055, 50=0.055, 100=0.038, 1000=0.026, 10000=0.018 (USD); Case/Package: 0603; Case Code (Imperial): 0603; Case Code (Metric): 1608; Dielectric Material: Ceramic; Min Operating Temperature: -55°C; Max Operating Temperature: 125°C; Tolerance: 5%; Packaging: Tape and Reel; Dielectric: X7R; Termination: SMD/SMT; Package Quantity: 4000; Voltage Rating (DC): 16V; Length: 1.6mm; Height: 0.8mm; Width: 0.8mm
C6 C7 C13 = C4u7_0603_C1608X5R1C475K080AE: CAP CER 0603 16V 4.70uF X5R 10%; Supplier 1: Mouser; Supplier Part Number 1: 810-C1608X5R1C475KE
C9 C11 = CMP-08246-002551-1: as C20 on sheet MCU; Termination: SMD/SMT; Packaging: Tape and Reel; Capacitance: 1uF; Tolerance: 10%; Mount: Surface Mount; Thickness: 0.035inch; Case Code (Imperial): 0603; Voltage Rating: 35V; Case/Package: 0603; Case Code (Metric): 1608; Dielectric: X7R; Width: 0.031inch; Length: 0.063inch; Min Operating Temperature: -55°C; Weight: 7.1E-05oz; Max Operating Temperature: 125°C; Voltage Rating (DC): 35V; Height: 0.8mm; Ratings: AEC-Q200; Package Quantity: 4000
C10 C51 C52 = C100n_0603_C0603C104J4RAC: Multilayer Ceramic Capacitors MLCC - SMD/SMT 16volts 0.1uF 5% X7R; Manufacturer: KEMET; Voltage Rating: 16V; Dissipation Factor: 3.5%; Supplier 1: Mouser; Supplier Part Number 1: 80-C0603C104J4RAC; Manufacturer Part Number: C0603C104J4RAC; Description 1: Multilayer Ceramic Capacitors MLCC - SMD/SMT 16volts 0.1uF 5% X7R; Stock 1: 0; Pricing 1: 1=0.14, 10=0.055, 50=0.055, 100=0.038, 1000=0.026, 10000=0.018 (USD); Case/Package: 0603; Case Code (Imperial): 0603; Case Code (Metric): 1608; Dielectric Material: Ceramic; Min Operating Temperature: -55°C; Max Operating Temperature: 125°C; Capacitance: 100nF; Tolerance: 5%; Packaging: Tape and Reel; Dielectric: X7R; Termination: SMD/SMT; Package Quantity: 4000; Voltage Rating (DC): 16V; Length: 1.6mm; Height: 0.8mm; Width: 0.8mm
C54 = CMP-2000-06846-2: Large Current 3 Terminals Low ESL Chip Multilayer Ceramic Capacitors for General Purpose, 1206, 27uF, 20%, 6.3V; Max Current Rating: 6A; DC Resistance (DCR): 5mR; Insulation Resistance: 20MR; Radiation Hardening: No; Height: 1.3mm; Lead Free: Lead Free; Voltage: 6.3V; Termination: Flat; Mount: Surface Mount; Case/Package: 1206; Capacitance: 27uF; Case Code (Imperial): 1206; Max Voltage Rating (DC): 6.3V; Min Operating Temperature: -40°C; Max Operating Temperature: 85°C; Package Quantity: 1; Length: 3.2mm; Tolerance: 20%; Case Code (Metric): 3216; Packaging: Tape and Reel; Voltage Rating (DC): 6.3V; REACH SVHC: No SVHC; Current Rating: 6A; Width: 1.6mm; Depth: 1.6mm; Current: 6A
D3 D4 = CMP-1426-00002-3: NexarPartId: 29687084; Color: Green; Power Dissipation: 105mW; Peak Wavelength: 515nm; Viewing Angle: 140°; Test Current: 20mA; Wavelength: 520nm; Lens Style: Clear, Rectangular; Max Junction Temperature (Tj): 95°C; Luminous Intensity: 430mcd; Output Current: 10µA; Max Reverse Voltage (DC): 5V; Forward Voltage: 3.2V; Dominant Wavelength: 525nm; Forward Current: 100mA; Mount: Surface Mount; Height: 700µm; Lead Free: Lead Free; Min Operating Temperature: -40°C; Max Operating Temperature: 85°C; Length: 1.6mm; Width: 800µm; Case/Package: 0603; Case Code (Imperial): 0603; Case Code (Metric): 1608; Packaging: Tape and Reel; Reverse Voltage: 5V; REACH SVHC: Unknown; RoHS: Compliant
FB1 = CMP-03913-130924275-1: 74269262601 Ferrite Bead, Suppression, 600 Ohm, 1.5A Rohs Compliant: Yes; DC Resistance (DCR): 90mΩ; NexarPartId: 130924275; Length: 1.6mm; Width: 800µm; Min Operating Temperature: -55°C; Current Rating: 1.5A; RoHS: Compliant; Max Operating Temperature: 125°C; Height: 800µm
IC1 = XC6210B502PR-G: LDO Voltage Regulators 700mA High Speed LDO Regulator   Source:  Datasheet; Manufacturer_Name: Torex; GateName_1: G$1; SymbolName_1: XC6210B502PR-G; LibraryName: XC6210B502PR-G; DeviceSetName: XC6210B502PR-G; Package: XC6210B502PRG; Mouser_Part_Number: 865-XC6210B502PR-G; Mouser_Price-Stock: https://www.mouser.co.uk/ProductDetail/Torex-Semiconductor/XC6210B502PR-G?qs=AsjdqWjXhJ8XXo5wZ7cEHQ%3D%3D; Manufacturer_Part_Number: XC6210B502PR-G; Height: 1.6mm
IC2 = TPS612592YFFR: No Description Available; Mfr_Name: Texas Instruments; Copyright: Copyright (C) 2024 Ultra Librarian. All rights reserved.; Manufacturer_Part_Number: TPS612592YFFR; RefDes: RefDes; Type: DEV
J2 = CMP-04776-000071-1: CONN HEADER SMD R/A 3POS 1.25MM; Manufacturer: Molex; Number Of Contacts: 3; Conn Orientation: Right Angle; Current Rating: 1A; Voltage Rating: 125V; Conn Gender: Male; Category: Conn; Automotive: No; Footprint Url: https://www.molex.com/pdm_docs/sd/532610371_sd.pdf; Height: 3.6mm; Number Of Rows: 1; Temperature Range Low: -40°C; Package: 0; Octopart: https://octopart.com/53261-0371-molex-655314; ComponentLink2Description: Datasheet; Lead Free: Yes; Ambient Temperature Range Low: -40°C; Device Class L3: unset; Mouser Description: 1.25mm (.049") Pitch PicoBlade Header, Surface Mount, Right Angle, Lead-free, 3 Circuits; Digikey Description: CONN HEADER SMD R/A 3POS 1.25MM; Device Class L2: Headers and Wire Housings; Contact Material: Tin,Nickel; Manufacturer Part Number: 53261-0371; Ambient Temperature Range High: +105°C; ComponentLink2URL: https://www.molex.com/webdocs/datasheets/pdf/en-us/0532610371_PCB_HEADERS.pdf; Pitch: 1.25mm; Temperature: -40°C to +105°C; RoHS: TRUE; Device Class L1: Connectors; Temperature Range High: +105°C
J8 = 15-91-6042: as J4 on sheet EMG_Sensor_Board; Manufacturer_Part_Number: 15-91-6042; Mouser Part Number: 538-15-91-6042; Mouser Price/Stock: https://www.mouser.co.uk/ProductDetail/Molex/15-91-6042?qs=3DzawVMofg8HeBuyct9LCA%3D%3D; Arrow Part Number: *; Arrow Price/Stock: *; Datasheet Link: https://componentsearchengine.com/Datasheets/1/15-91-6042.pdf
L1 = CMP-02424-000048-1: Fixed Inductors Automotive High Saturation Series SMT 1uH 3.75A 37mΩ 20%; DC Resistance (DCR): 37mR; Test Frequency: 100kHz; Self Resonant Frequency: 90MHz; Connector Type: Power; Shielding: Shielded; Lead Free: Lead Free; Length: 4.45mm; Min Operating Temperature: -55°C; Case/Package: 1616; Radiation Hardening: No; Height: 2mm; Inductance: 1uH; Packaging: Tape and Reel; Termination: SMD/SMT; Max DC Current: 3.75A; Package Quantity: 4000; Depth: 4.31mm; Width: 4.06mm; Tolerance: 20%; Max Operating Temperature: 125°C; Military Standard: Not
R1 = CMP-2100-03664-2: RES 10K OHM 1% 1/10W 0603; Voltage Rating: 75V; Voltage Rating (DC): 50V; Resistance: 10kR; Power Rating: 100mW; Temperature Coefficient: 100ppm/°C; Depth: 0.8mm; Termination: SMD/SMT; Resistor Type: Thick Film; Series: RC; Construction: Rectangular; Features: Moisture Resistant; Packaging: Tape and Reel; Min Operating Temperature: -55°C; Number of Terminations: 2; Lead Pitch: 0.3mm; RoHS Compliant: Yes; Case/Package: 0603; Resistance Tolerance: 1%; Military Standard: Not; Weight: 7.1E-05oz; Number of Pins: 2; Tolerance: 1%; Length: 1.6mm; Case Code (Imperial): 0603; Lead Free: Lead Free; Width: 0.8mm; Max Power Dissipation: 100mW; Height: 0.45mm; Max Operating Temperature: 155°C; Case Code (Metric): 1608; Size Code: 0603
R2 = CMP-2000-00435-2: as R24 on sheet EMG_Sensor_Board; REACH SVHC: No SVHC; PackageDescription: 2-Pin Surface Mount Device, Body 1.6 x 0.85 mm; Contact Finish: Gold; Pins: 8; ComponentLink1Description: Manufacturer URL; Packaging: Tape and Reel; Max Operating Temperature: 85 degC; Contact Material: Copper; Height: 1.45 mm; Width: 1.45 mm; DatasheetVersion: Apr-15; Package Quantity: 1500; Contact Plating: Gold; PackageReference: 0603; Mount: Surface Mount; Lead Pitch: 1.1 mm; Min Operating Temperature: -25 degC; ComponentLink1URL: http://www.panasonic.com/; ComponentLink2URL: http://industrial.panasonic.com/cdbs/www-data/pdf/RDA0000/AOA0000C86.pdf; Length: 13.7 mm; ComponentLink2Description: Datasheet; RoHSCompliant: true
R3 = R2k_0603_ERA-3AEB202V: PANASONIC ELECTRONIC COMPONENTS         ERA3AEB202V             SMD Chip Resistor, Thin Film, 2 kohm, 75 V, 0603 [1608 Metric], 100 mW,  0.1%, ERA Series; Resistance: 2kR; Temperature Coefficient: 25ppm/°C; Voltage Rating: 75V; Power Rating: 100mW; Supplier 1: Farnell; Supplier Part Number 1: 1811500RL; Manufacturer: Panasonic; Manufacturer Part Number: ERA-3AEB202V; Description 1: PANASONIC ELECTRONIC COMPONENTS         ERA3AEB202V             SMD Chip Resistor, Thin Film, 2 kohm, 75 V, 0603 [1608 Metric], 100 mW,  0.1%, ERA Series; Stock 1: 0; Mount: Surface Mount; Case/Package: 0603; Number of Pins: 2; Contact Plating: Tin; Case Code (Metric): 1608; Case Code (Imperial): 0603; Min Operating Temperature: -55°C; Max Operating Temperature: 155°C; Tolerance: 0.1%; Composition: Thin Film; Packaging: Tape and Reel; Package Quantity: 5000; Termination: SMD/SMT; Number of Terminations: 2; Military Standard: Not; Max Power Dissipation: 100mW; Voltage Rating (DC): 75V; Working Voltage: 75V; Length: 1.6mm; Height: 0.45mm; Width: 0.8mm; Depth: 0.8mm; Radiation Hardening: No; REACH SVHC: No SVHC; Lead Free: Lead Free; ComponentLink1URL: http://www.farnell.com/datasheets/2052875.pdf; ComponentLink1Description: http://www.farnell.com/datasheets/2052875.pdf; ComponentLink2URL: http://www.farnell.com/datasheets/1776116.pdf; ComponentLink2Description: http://www.farnell.com/datasheets/1776116.pdf; ComponentLink3URL: http://www.farnell.com/datasheets/2059650.pdf; ComponentLink3Description: http://www.farnell.com/datasheets/2059650.pdf; ComponentLink4URL: http://www.alliedelec.com/m/d/b6b0537e86f421aa7f5975bb1d8f429a.pdf; ComponentLink4Description: http://www.alliedelec.com/m/d/b6b0537e86f421aa7f5975bb1d8f429a.pdf; ComponentLink5URL: http://www.farnell.com/datasheets/485442.pdf; ComponentLink5Description: http://www.farnell.com/datasheets/485442.pdf; ComponentLink6URL: https://www.distrelec.biz/Web/Downloads/_t/ds/ERA_eng_tds.pdf?mime=application%2Fpdf; ComponentLink6Description: https://www.distrelec.biz/Web/Downloads/_t/ds/ERA_eng_tds.pdf?mime=application%2Fpdf; ComponentLink7URL: http://industrial.panasonic.com/www-data/pdf/AOA0000/AOA0000CE26.pdf; ComponentLink7Description: http://industrial.panasonic.com/www-data/pdf/AOA0000/AOA0000CE26.pdf; ComponentLink8URL: http://www.produktinfo.conrad.com/datenblaetter/450000-474999/450879-da-01-en-WIDERSTAND_0603_ERA.pdf; ComponentLink8Description: http://www.produktinfo.conrad.com/datenblaetter/450000-474999/450879-da-01-en-WIDERSTAND_0603_ERA.pdf
R4 = CMP-2000-03818-2: RES Thick Film, 0Ω, 0.1W, 0603; Resistance: 0mR; Power Rating: 100mW; Voltage Rating (DC): 75V; Temperature Coefficient: 100ppm/°C; Tolerance: 1%; Height: 0.45mm; Features: Automotive AEC-Q200; Number of Terminations: 2; Termination: SMD/SMT; Military Standard: Not; Case/Package: 0603; Max Operating Temperature: 155°C; Width: 0.033inch; Composition: Thick Film; Contact Plating: Tin; Length: 1.55mm; Max Power Dissipation: 100mW; Number of Pins: 2; Weight: 7.1E-05oz; Depth: 0.85mm; Radiation Hardening: No; Lead Free: Lead Free; Voltage Rating: 75V; Packaging: Tape and Reel; Package Quantity: 10000; Min Operating Temperature: -55°C; Case Code (Metric): 1608; Case Code (Imperial): 0603
R5 = CMP-2000-00539-1: Manufacturer: Panasonic; Part Number: ERJ3EKF5100V
T1 = MOSFET P: Mouser-Nr.:621-DMP1045U-7; Supplier Part Number 1: 621-DMP1045U-7; Supplier 1: Mouser
U1 = U_SOT23-6_REG710NA-3.3: Schaltspannungsregler 30-mA Switched-Cap DC-DC Converter, Buck-Boost, Vout = 3.3V; Supplier 1: Mouser; Supplier Part Number 1: 595-REG710NA-3.3/3K
U2 = MCP73832: Supplier 1: Mouser; Supplier Part Number 1: 579-MCP73832T-2ACIOT